# EAGLE schematic sdfg (EAGLE 7.3.0)
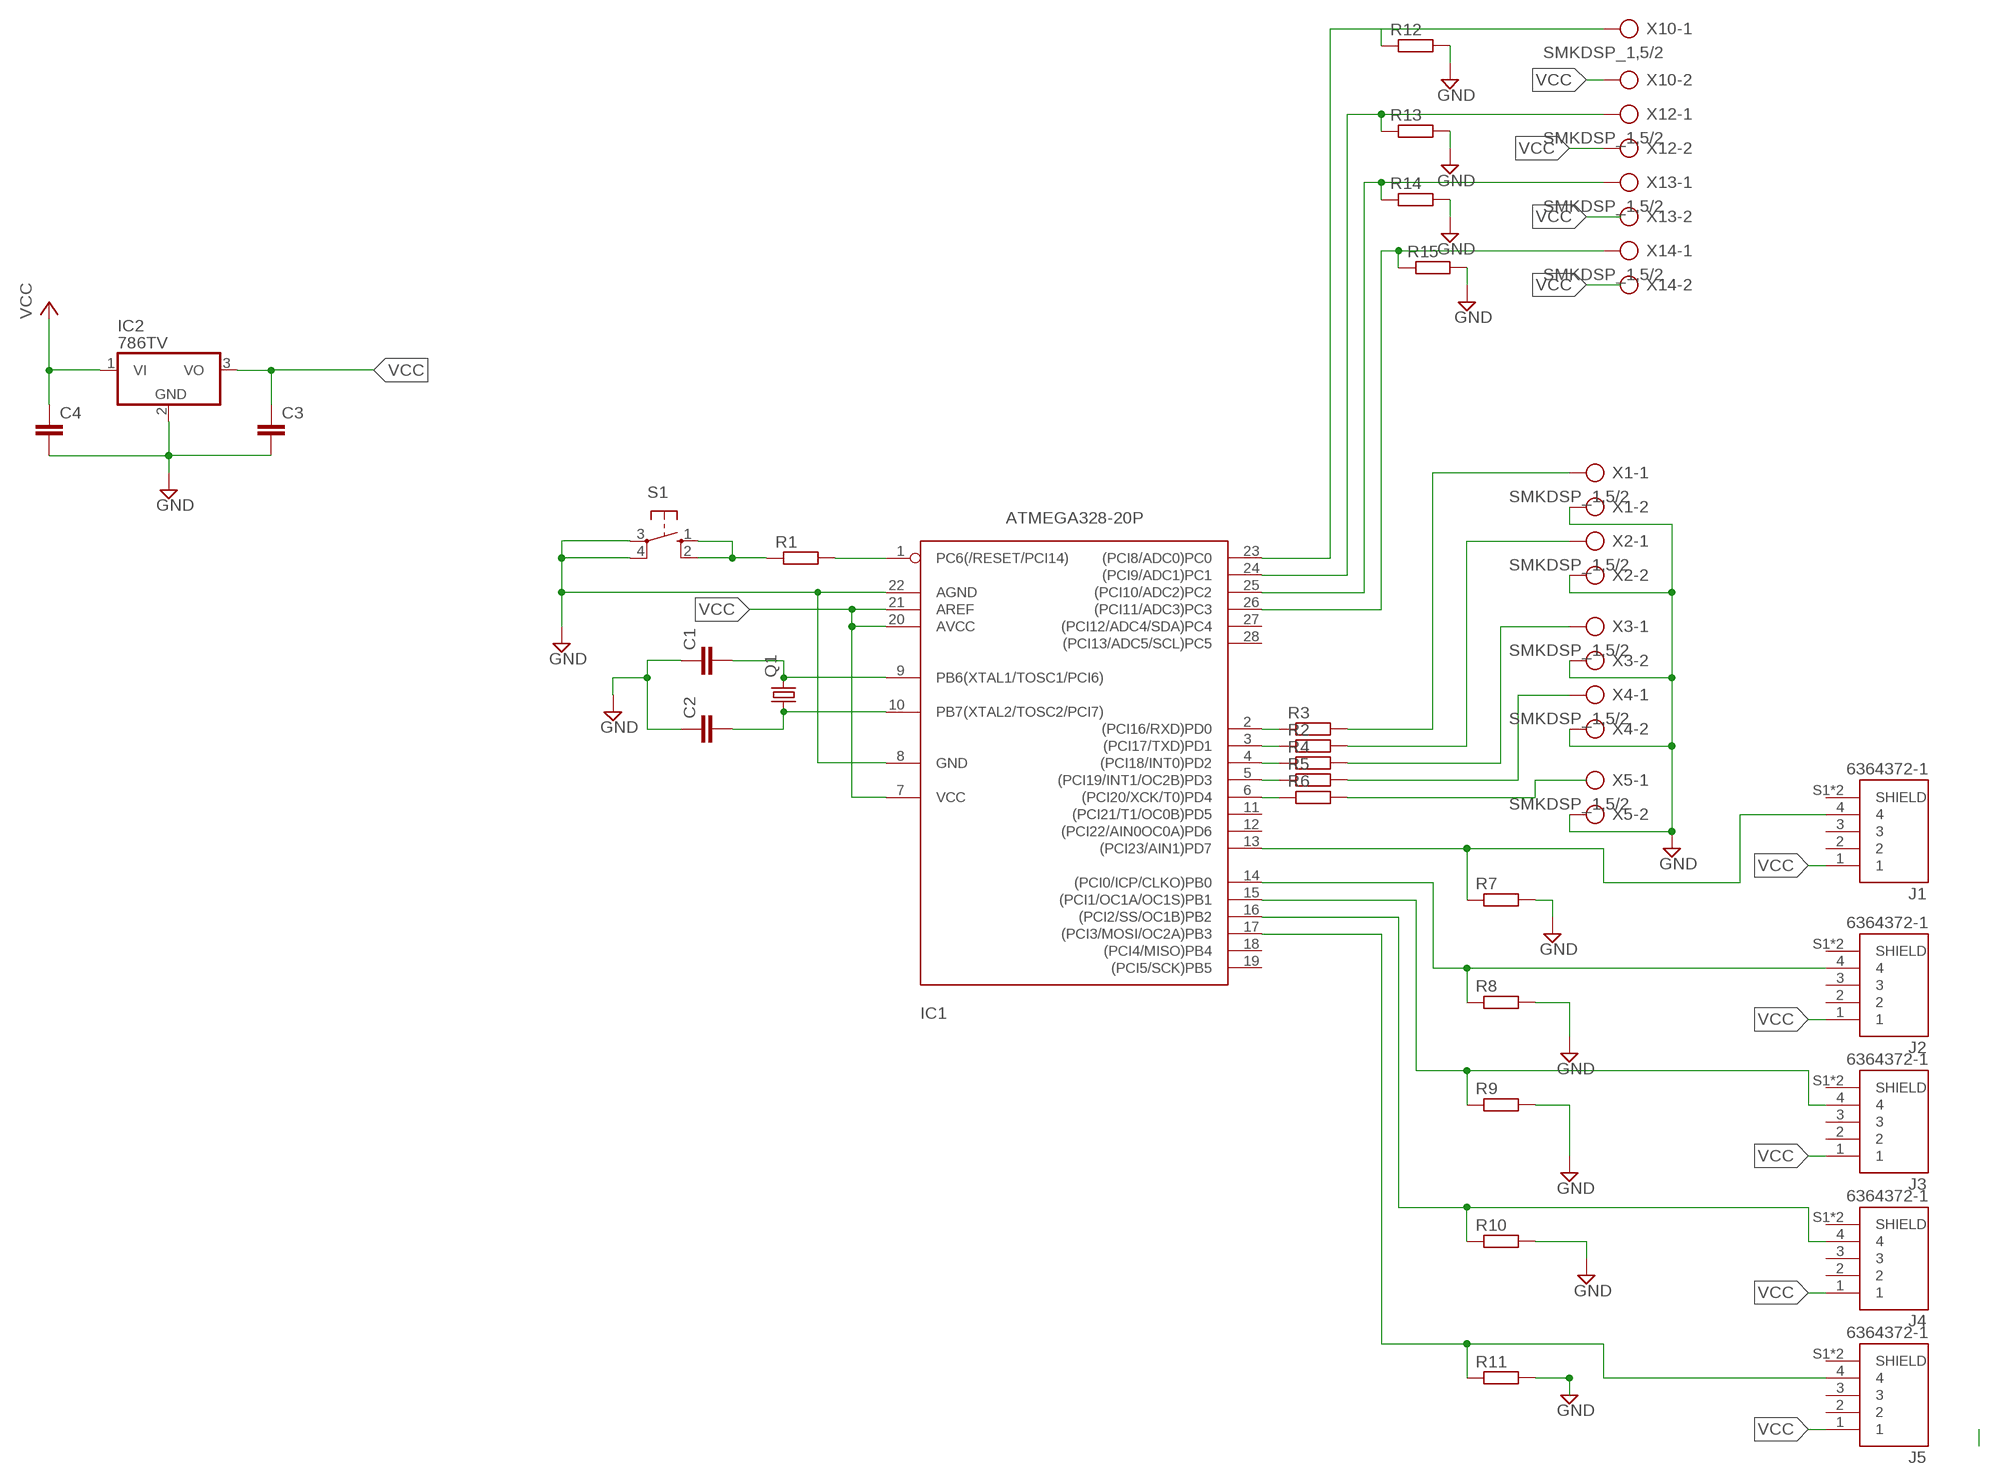
[diagram p0: schematic, sheet 1]

## Parts
C1  C-EU025-030X050  [C025-030X050]
C2  C-EU025-030X050  [C025-030X050]
C3  C-EU025-025X050  [C025-025X050]
C4  C-EU025-025X050  [C025-025X050]
IC1  ATMEGA328-20P  [DIL28-3]
IC2  786TV  [TO220V]
J1  6364372-1  [TE_6364372-1]
J2  6364372-1  [TE_6364372-1]
J3  6364372-1  [TE_6364372-1]
J4  6364372-1  [TE_6364372-1]
J5  6364372-1  [TE_6364372-1]
Q1  CRYSTALHC49U70  [HC49U70]
R1  R-EU_0204/5  [0204/5]
R2  R-EU_0204/5  [0204/5]
R3  R-EU_0204/5  [0204/5]
R4  R-EU_0204/5  [0204/5]
R5  R-EU_0204/5  [0204/5]
R6  R-EU_0204/5  [0204/5]
R7  R-EU_0204/5  [0204/5]
R8  R-EU_0204/5  [0204/5]
R9  R-EU_0204/5  [0204/5]
R10  R-EU_0204/5  [0204/5]
R11  R-EU_0204/5  [0204/5]
R12  R-EU_0204/5  [0204/5]
R13  R-EU_0204/5  [0204/5]
R14  R-EU_0204/5  [0204/5]
R15  R-EU_0204/5  [0204/5]
S1  10-XX  [B3F-10XX]
X1  SMKDSP_1,5/2  [SMKDSP_1,5/2]
X2  SMKDSP_1,5/2  [SMKDSP_1,5/2]
X3  SMKDSP_1,5/2  [SMKDSP_1,5/2]
X4  SMKDSP_1,5/2  [SMKDSP_1,5/2]
X5  SMKDSP_1,5/2  [SMKDSP_1,5/2]
X10  SMKDSP_1,5/2  [SMKDSP_1,5/2]
X12  SMKDSP_1,5/2  [SMKDSP_1,5/2]
X13  SMKDSP_1,5/2  [SMKDSP_1,5/2]
X14  SMKDSP_1,5/2  [SMKDSP_1,5/2]

## Nets
GND: C1.1 C2.1 C3.2 C4.2 IC1.8(GND) IC1.22(AGND) IC2.2(GND) R7.2 R8.2 R9.2 R10.2 R11.2 R12.2 R13.2 R14.2 R15.2 S1.3(P) S1.4(P1) X1.2 X2.2 X3.2 X4.2 X5.2
N$1: C1.2 IC1.9(PB6(XTAL1/TOSC1/PCI6)) Q1.2
N$2: C2.2 IC1.10(PB7(XTAL2/TOSC2/PCI7)) Q1.1
N$3: IC1.1(PC6(/RESET/PCI14)) R1.2
N$4: R1.1 S1.1(S) S1.2(S1)
N$5: IC1.2((PCI16/RXD)PD0) R3.1
N$6: IC1.3((PCI17/TXD)PD1) R2.1
N$7: IC1.4((PCI18/INT0)PD2) R4.1
N$8: IC1.5((PCI19/INT1/OC2B)PD3) R5.1
N$9: IC1.6((PCI20/XCK/T0)PD4) R6.1
N$10: IC1.13((PCI23/AIN1)PD7) J1.4 R7.1
N$11: IC1.14((PCI0/ICP/CLKO)PB0) J2.4 R8.1
N$12: IC1.15((PCI1/OC1A/OC1S)PB1) J3.4 R9.1
N$13: IC1.16((PCI2/SS/OC1B)PB2) J4.4 R10.1
N$14: IC1.17((PCI3/MOSI/OC2A)PB3) J5.4 R11.1
N$15: R3.2 X1.1
N$16: R2.2 X2.1
N$17: R4.2 X3.1
N$18: R5.2 X4.1
N$19: R6.2
N$20: J1.1
N$22: J3.1
N$23: J4.1
N$24: J5.1
N$25: IC1.23((PCI8/ADC0)PC0) R12.1 X10.1
N$27: IC1.24((PCI9/ADC1)PC1) R13.1 X12.1
N$28: IC1.25((PCI10/ADC2)PC2) R14.1 X13.1
N$29: IC1.26((PCI11/ADC3)PC3) R15.1 X14.1
N$30: X10.2
N$35: X12.2
VCC: C3.1 C4.1 IC1.7(VCC) IC1.20(AVCC) IC1.21(AREF) IC2.1(VI) IC2.3(VO) J2.1
Unconnected: IC1.11((PCI21/T1/OC0B)PD5) IC1.12((PCI22/AIN0OC0A)PD6) IC1.18((PCI4/MISO)PB4) IC1.19((PCI5/SCK)PB5) IC1.27((PCI12/ADC4/SDA)PC4) IC1.28((PCI13/ADC5/SCL)PC5) J1.2 J1.3 J1.S1(SHIELD) J1.S2(SHIELD) J2.2 J2.3 J2.S1(SHIELD) J2.S2(SHIELD) J3.2 J3.3 J3.S1(SHIELD) J3.S2(SHIELD) J4.2 J4.3 J4.S1(SHIELD) J4.S2(SHIELD) J5.2 J5.3 J5.S1(SHIELD) J5.S2(SHIELD) X5.1 X13.2 X14.2

## Library data of the parts
C1-C4 = rcl:C-EU: CAPACITOR, European symbol
IC1 = atmega328:ATMEGA328*P: MICROCONTROLLER 32 kBytes FLASH 2 kBytes SRAM 1 kBytes EEPROM USART 8-channel 10 bit ADC
IC2 = linear:78*: Positive VOLTAGE REGULATOR Source: http://cache.national.com/ds/LM/LM78L05.pdf http://www.fairchildsemi.com/ds/LM/LM7805.pdf
J1-J5 = 6364372-1:6364372-1: CONN RCPT USB TYPE A PCB R/A; AVAILABILITY: Bad; CENTERLINE_PITCH: 2 mm[.078 in]; COMMENT: 6364372-1; DESCRIPTION: RECP ASSY, R/A, 4P, THRU-HOLE, USB, LF; EU_ROHS_COMPLIANCE: Compliant; LINK: http://www.te.com/usa-en/product-6364372-1.html; MF: TE Connectivity; MP: 6364372-1; NUMBER_OF_POSITIONS: 4; PACKAGE: None; PRICE: 0.72 USD; PRODUCT_TYPE: Connector
Q1 = crystal:CRYSTAL: CRYSTAL; OC_FARNELL: unknown; OC_NEWARK: unknown
R1-R15 = rcl:R-EU_: RESISTOR, European symbol
S1 = switch-omron:10-XX: OMRON SWITCH; MPN: B3F-1000; OC_FARNELL: 176432; OC_NEWARK: 36M3542
X1-X5 X10 X12-X14 = con-phoenix-smkdsp:SMKDSP_1,5/2: Printklemme, Nennstrom: 17,5 A, Bemessungsspannung: 250 V, Raster: 5,0 mm Source: http://eshop.phoenixcontact.de .. 1733415.pdf; MF: FARNELL; MPN: 1733570; OC_FARNELL: 3041244; OC_NEWARK: 69C8588